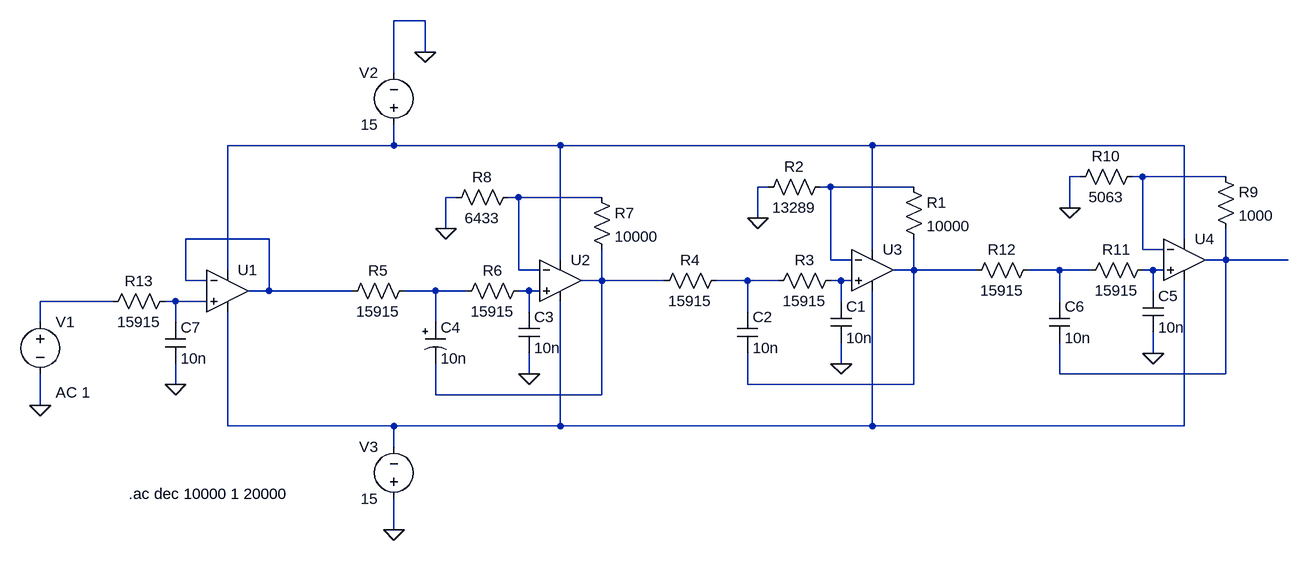
[diagram p0: schematic passa_baixa.asc]
passa_baixa.asc, the LTspice schematic file:
Version 4
SHEET 1 1572 1076
WIRE -320 -656 -368 -656
WIRE -320 -608 -320 -656
WIRE -368 -576 -368 -656
WIRE -368 -464 -368 -496
WIRE -368 -464 -624 -464
WIRE -112 -464 -368 -464
WIRE 368 -464 -112 -464
WIRE 848 -464 368 -464
WIRE 688 -416 672 -416
WIRE 784 -416 768 -416
WIRE 912 -416 784 -416
WIRE 208 -400 192 -400
WIRE 304 -400 288 -400
WIRE 432 -400 304 -400
WIRE -272 -384 -288 -384
WIRE -176 -384 -192 -384
WIRE -48 -384 -176 -384
WIRE 672 -368 672 -416
WIRE 192 -352 192 -400
WIRE -288 -336 -288 -384
WIRE -560 -320 -688 -320
WIRE 848 -320 848 -464
WIRE 368 -304 368 -464
WIRE 784 -304 784 -416
WIRE 816 -304 784 -304
WIRE -112 -288 -112 -464
WIRE 304 -288 304 -400
WIRE 336 -288 304 -288
WIRE 912 -288 912 -336
WIRE 912 -288 880 -288
WIRE 1008 -288 912 -288
WIRE -624 -272 -624 -464
WIRE -176 -272 -176 -384
WIRE -144 -272 -176 -272
WIRE 432 -272 432 -320
WIRE 432 -272 400 -272
WIRE 528 -272 432 -272
WIRE 656 -272 608 -272
WIRE 704 -272 656 -272
WIRE 800 -272 784 -272
WIRE 816 -272 800 -272
WIRE -688 -256 -688 -320
WIRE -656 -256 -688 -256
WIRE -48 -256 -48 -304
WIRE -48 -256 -80 -256
WIRE 48 -256 -48 -256
WIRE 176 -256 128 -256
WIRE 224 -256 176 -256
WIRE 320 -256 304 -256
WIRE 336 -256 320 -256
WIRE -560 -240 -560 -320
WIRE -560 -240 -592 -240
WIRE -432 -240 -560 -240
WIRE -304 -240 -352 -240
WIRE -256 -240 -304 -240
WIRE -160 -240 -176 -240
WIRE -144 -240 -160 -240
WIRE 800 -240 800 -272
WIRE -800 -224 -912 -224
WIRE -704 -224 -720 -224
WIRE -656 -224 -704 -224
WIRE 320 -224 320 -256
WIRE 656 -224 656 -272
WIRE -160 -208 -160 -240
WIRE 176 -208 176 -256
WIRE -912 -192 -912 -224
WIRE -704 -192 -704 -224
WIRE -304 -192 -304 -240
WIRE 800 -144 800 -176
WIRE 320 -128 320 -160
WIRE -160 -112 -160 -144
WIRE 656 -112 656 -160
WIRE 912 -112 912 -288
WIRE 912 -112 656 -112
WIRE -704 -96 -704 -128
WIRE 176 -96 176 -144
WIRE 432 -96 432 -272
WIRE 432 -96 176 -96
WIRE -304 -80 -304 -128
WIRE -48 -80 -48 -256
WIRE -48 -80 -304 -80
WIRE -912 -64 -912 -112
WIRE -624 -32 -624 -208
WIRE -368 -32 -624 -32
WIRE -112 -32 -112 -224
WIRE -112 -32 -368 -32
WIRE 368 -32 368 -240
WIRE 368 -32 -112 -32
WIRE 848 -32 848 -256
WIRE 848 -32 368 -32
WIRE -368 0 -368 -32
WIRE -368 128 -368 80
FLAG -320 -608 0
FLAG -160 -112 0
FLAG -288 -336 0
FLAG -912 -64 0
FLAG -368 128 0
FLAG 320 -128 0
FLAG 192 -352 0
FLAG 800 -144 0
FLAG 672 -368 0
FLAG -704 -96 0
SYMBOL Opamps\\UniversalOpamp2 -112 -256 R0
SYMATTR InstName U2
SYMBOL res -64 -400 R0
SYMATTR InstName R7
SYMATTR Value 10000
SYMBOL res -288 -368 R270
WINDOW 0 32 56 VTop 2
WINDOW 3 0 56 VBottom 2
SYMATTR InstName R8
SYMATTR Value 6433
SYMBOL voltage -912 -208 R0
WINDOW 123 24 124 Left 2
WINDOW 39 0 0 Left 2
SYMATTR Value2 AC 1
SYMATTR InstName V1
SYMATTR Value ""
SYMBOL voltage -368 -480 R180
WINDOW 0 24 96 Left 2
WINDOW 3 24 16 Left 2
WINDOW 123 0 0 Left 2
WINDOW 39 0 0 Left 2
SYMATTR InstName V2
SYMATTR Value 15
SYMBOL voltage -368 96 R180
WINDOW 0 24 96 Left 2
WINDOW 3 24 16 Left 2
WINDOW 123 0 0 Left 2
WINDOW 39 0 0 Left 2
SYMATTR InstName V3
SYMATTR Value 15
SYMBOL cap -176 -208 R0
SYMATTR InstName C3
SYMATTR Value 10n
SYMBOL polcap -320 -192 R0
WINDOW 3 24 56 Left 2
SYMATTR Value 10n
SYMATTR InstName C4
SYMATTR Description Capacitor
SYMATTR Type cap
SYMBOL res -160 -256 R90
WINDOW 0 0 56 VBottom 2
WINDOW 3 32 56 VTop 2
SYMATTR InstName R6
SYMATTR Value 15915
SYMBOL res -336 -256 R90
WINDOW 0 0 56 VBottom 2
WINDOW 3 32 56 VTop 2
SYMATTR InstName R5
SYMATTR Value 15915
SYMBOL Opamps\\UniversalOpamp2 -624 -240 R0
SYMATTR InstName U1
SYMBOL Opamps\\UniversalOpamp2 368 -272 R0
SYMATTR InstName U3
SYMBOL res 416 -416 R0
SYMATTR InstName R1
SYMATTR Value 10000
SYMBOL res 192 -384 R270
WINDOW 0 32 56 VTop 2
WINDOW 3 0 56 VBottom 2
SYMATTR InstName R2
SYMATTR Value 13289
SYMBOL cap 304 -224 R0
SYMATTR InstName C1
SYMATTR Value 10n
SYMBOL cap 160 -208 R0
SYMATTR InstName C2
SYMATTR Value 10n
SYMBOL res 320 -272 R90
WINDOW 0 0 56 VBottom 2
WINDOW 3 32 56 VTop 2
SYMATTR InstName R3
SYMATTR Value 15915
SYMBOL res 144 -272 R90
WINDOW 0 0 56 VBottom 2
WINDOW 3 32 56 VTop 2
SYMATTR InstName R4
SYMATTR Value 15915
SYMBOL Opamps\\UniversalOpamp2 848 -288 R0
SYMATTR InstName U4
SYMBOL res 896 -432 R0
SYMATTR InstName R9
SYMATTR Value 1000
SYMBOL res 672 -400 R270
WINDOW 0 32 56 VTop 2
WINDOW 3 0 56 VBottom 2
SYMATTR InstName R10
SYMATTR Value 5063
SYMBOL cap 784 -240 R0
SYMATTR InstName C5
SYMATTR Value 10n
SYMBOL cap 640 -224 R0
SYMATTR InstName C6
SYMATTR Value 10n
SYMBOL res 800 -288 R90
WINDOW 0 0 56 VBottom 2
WINDOW 3 32 56 VTop 2
SYMATTR InstName R11
SYMATTR Value 15915
SYMBOL res 624 -288 R90
WINDOW 0 0 56 VBottom 2
WINDOW 3 32 56 VTop 2
SYMATTR InstName R12
SYMATTR Value 15915
SYMBOL res -704 -240 R90
WINDOW 0 0 56 VBottom 2
WINDOW 3 32 56 VTop 2
SYMATTR InstName R13
SYMATTR Value 15915
SYMBOL cap -720 -192 R0
SYMATTR InstName C7
SYMATTR Value 10n
TEXT -776 72 Left 2 !.ac dec 10000 1 20000

The netlist it stands for:
* passa_baixa.asc
XU2 N014 N004 N001 N017 N010 level.2 Avol=1Meg GBW=10Meg Slew=10Meg ilimit=25m rail=0 Vos=0 phimargin=45 en=0 enk=0 in=0 ink=0 Rin=500Meg  ; pins IN+ IN- V+ V- OUT
R7 N004 N010 10000
R8 0 N004 6433
V1 N015 0 AC 1
V2 N001 0 15
V3 0 N017 15
C3 N014 0 10n
C4 N013 N010 10n
R6 N014 N013 15915
R5 N013 N005 15915
XU1 N016 N005 N001 N017 N005 level.2 Avol=1Meg GBW=10Meg Slew=10Meg ilimit=25m rail=0 Vos=0 phimargin=45 en=0 enk=0 in=0 ink=0 Rin=500Meg  ; pins IN+ IN- V+ V- OUT
XU3 N012 N003 N001 N017 N007 level.2 Avol=1Meg GBW=10Meg Slew=10Meg ilimit=25m rail=0 Vos=0 phimargin=45 en=0 enk=0 in=0 ink=0 Rin=500Meg  ; pins IN+ IN- V+ V- OUT
R1 N003 N007 10000
R2 0 N003 13289
C1 N012 0 10n
C2 N011 N007 10n
R3 N012 N011 15915
R4 N011 N010 15915
XU4 N009 N002 N001 N017 N006 level.2 Avol=1Meg GBW=10Meg Slew=10Meg ilimit=25m rail=0 Vos=0 phimargin=45 en=0 enk=0 in=0 ink=0 Rin=500Meg  ; pins IN+ IN- V+ V- OUT
R9 N002 N006 1000
R10 0 N002 5063
C5 N009 0 10n
C6 N008 N006 10n
R11 N009 N008 15915
R12 N008 N007 15915
R13 N016 N015 15915
C7 N016 0 10n
.ac dec 10000 1 20000
.lib UniversalOpamps2.sub
.backanno
.end